# Altium project Bus.PrjPcb
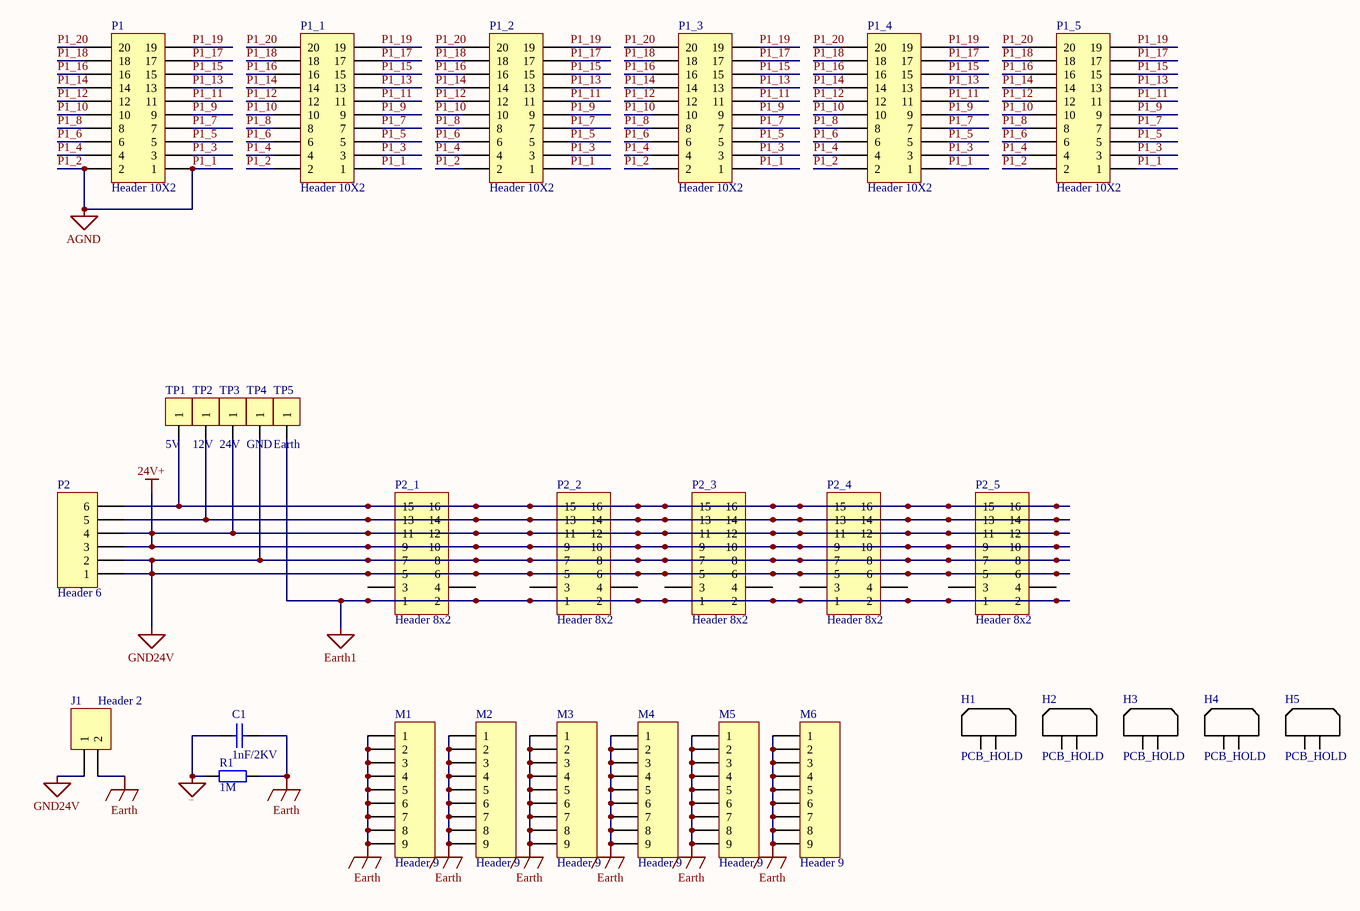
[diagram p0: Bus.SchDoc]
1 sheet, 31 parts. Net scope: global (net labels, ports and power ports of the same name join across sheets).
Board file: Bus.PcbDoc

## Sheet Bus.SchDoc
size A3

### Parts
C1  1nF/2KV  [1206_C]
H1  PCB_HOLD  [PCB_HOLD]
H2  PCB_HOLD  [PCB_HOLD]
H3  PCB_HOLD  [PCB_HOLD]
H4  PCB_HOLD  [PCB_HOLD]
H5  PCB_HOLD  [PCB_HOLD]
J1  Header 2  [HDR1X2]
M1  Header 9  [LK]
M2  Header 9  [LK]
M3  Header 9  [LK]
M4  Header 9  [LK]
M5  Header 9  [LK]
M6  Header 9  [LK]
P1  Header 10X2  [HDR2X10]
P1_1  Header 10X2  [HDR2X10]
P1_2  Header 10X2  [HDR2X10]
P1_3  Header 10X2  [HDR2X10]
P1_4  Header 10X2  [HDR2X10]
P1_5  Header 10X2  [HDR2X10]
P2  Header 6  [15EDG-6-R]
P2_1  Header 8x2  [HDR2X8]
P2_2  Header 8x2  [HDR2X8]
P2_3  Header 8x2  [HDR2X8]
P2_4  Header 8x2  [HDR2X8]
P2_5  Header 8x2  [HDR2X8]
R1  1M  [1206_R]
TP1  5V  [TP]
TP2  12V  [TP]
TP3  24V  [TP]
TP4  GND  [TP]
TP5  Earth  [TP]

### Nets
24V+: P2.3 P2.4 P2_1.9 P2_1.10 P2_1.11 P2_1.12 P2_2.9 P2_2.10 P2_2.11 P2_2.12 P2_3.9 P2_3.10 P2_3.11 P2_3.12 P2_4.9 P2_4.10 P2_4.11 P2_4.12 P2_5.9 P2_5.10 P2_5.11 P2_5.12 TP3.1
Earth: C1.1 J1.2 M1.1 M1.2 M1.3 M1.4 M1.5 M1.6 M1.7 M1.8 M1.9 M2.1 M2.2 M2.3 M2.4 M2.5 M2.6 M2.7 M2.8 M2.9 M3.1 M3.2 M3.3 M3.4 M3.5 M3.6 M3.7 M3.8 M3.9 M4.1 M4.2 M4.3 M4.4 M4.5 M4.6 M4.7 M4.8 M4.9 M5.1 M5.2 M5.3 M5.4 M5.5 M5.6 M5.7 M5.8 M5.9 M6.1 M6.2 M6.3 M6.4 M6.5 M6.6 M6.7 M6.8 M6.9 R1.2
Earth1: C1.2 P2_1.1 P2_1.2 P2_2.1 P2_2.2 P2_3.1 P2_3.2 P2_4.1 P2_4.2 P2_5.1 P2_5.2 R1.1 TP5.1
GND24V: J1.1 P2.1 P2.2 P2_1.5 P2_1.6 P2_1.7 P2_1.8 P2_2.5 P2_2.6 P2_2.7 P2_2.8 P2_3.5 P2_3.6 P2_3.7 P2_3.8 P2_4.5 P2_4.6 P2_4.7 P2_4.8 P2_5.5 P2_5.6 P2_5.7 P2_5.8 TP4.1
P1_1: P1.1 P1.2 P1_1.1 P1_1.2 P1_2.1 P1_2.2 P1_3.1 P1_3.2 P1_4.1 P1_4.2 P1_5.1 P1_5.2  [also labelled AGND, P1_2]
P1_3: P1.3 P1_1.3 P1_2.3 P1_3.3 P1_4.3 P1_5.3
P1_4: P1.4 P1_1.4 P1_2.4 P1_3.4 P1_4.4 P1_5.4
P1_5: P1.5 P1_1.5 P1_2.5 P1_3.5 P1_4.5 P1_5.5
P1_6: P1.6 P1_1.6 P1_2.6 P1_3.6 P1_4.6 P1_5.6
P1_7: P1.7 P1_1.7 P1_2.7 P1_3.7 P1_4.7 P1_5.7
P1_8: P1.8 P1_1.8 P1_2.8 P1_3.8 P1_4.8 P1_5.8
P1_9: P1.9 P1_1.9 P1_2.9 P1_3.9 P1_4.9 P1_5.9
P1_10: P1.10 P1_1.10 P1_2.10 P1_3.10 P1_4.10 P1_5.10
P1_11: P1.11 P1_1.11 P1_2.11 P1_3.11 P1_4.11 P1_5.11
P1_12: P1.12 P1_1.12 P1_2.12 P1_3.12 P1_4.12 P1_5.12
P1_13: P1.13 P1_1.13 P1_2.13 P1_3.13 P1_4.13 P1_5.13
P1_14: P1.14 P1_1.14 P1_2.14 P1_3.14 P1_4.14 P1_5.14
P1_15: P1.15 P1_1.15 P1_2.15 P1_3.15 P1_4.15 P1_5.15
P1_16: P1.16 P1_1.16 P1_2.16 P1_3.16 P1_4.16 P1_5.16
P1_17: P1.17 P1_1.17 P1_2.17 P1_3.17 P1_4.17 P1_5.17
P1_18: P1.18 P1_1.18 P1_2.18 P1_3.18 P1_4.18 P1_5.18
P1_19: P1.19 P1_1.19 P1_2.19 P1_3.19 P1_4.19 P1_5.19
P1_20: P1.20 P1_1.20 P1_2.20 P1_3.20 P1_4.20 P1_5.20
NetP2_5: P2.5 P2_1.13 P2_1.14 P2_2.13 P2_2.14 P2_3.13 P2_3.14 P2_4.13 P2_4.14 P2_5.13 P2_5.14 TP2.1
NetP2_6: P2.6 P2_1.15 P2_1.16 P2_2.15 P2_2.16 P2_3.15 P2_3.16 P2_4.15 P2_4.16 P2_5.15 P2_5.16 TP1.1

Not connected (* = marked no-connect by the designer): P2_1 3 4; P2_2 3 4; P2_3 3 4; P2_4 3 4; P2_5 3 4

### Library data of the parts
C1 = CC: Capacitor
J1 = Header 2: Header, 2-Pin; LatestRevisionDate: 17-Jul-2002; LatestRevisionNote: Re-released for DXP Platform.; Publisher: Altium Limited
M1-M6 = Header 9: Header, 9-Pin; LatestRevisionDate: 17-Jul-2002; LatestRevisionNote: Re-released for DXP Platform.; Publisher: Altium Limited
P1 P1_1-P1_5 = Header 10X2: Header, 10-Pin, Dual row; LatestRevisionDate: 17-Jul-2002; LatestRevisionNote: Re-released for DXP Platform.; Publisher: Altium Limited
P2 = Header 6: Header, 6-Pin; LatestRevisionDate: 17-Jul-2002; LatestRevisionNote: Re-released for DXP Platform.; Publisher: Altium Limited
P2_1-P2_5 = Header 8x2: Header, 8-Pin, Dual row; LatestRevisionDate: 17-Jul-2002; LatestRevisionNote: Re-released for DXP Platform.; Publisher: Altium Limited
R1 = Res2: Resistor; Value: 1K; Published: 8-Jun-2000; LatestRevisionDate: 17-Jul-2002; LatestRevisionNote: Re-released for DXP Platform.; PackageReference: AXIAL-0.4; Publisher: Altium Limited
TP1-TP5 = TP: LatestRevisionDate: 17-Jul-2002; LatestRevisionNote: Re-released for DXP Platform.; Publisher: Altium Limited
H1-H5 = PCB_HOLD: LatestRevisionDate: 17-Jul-2002; LatestRevisionNote: Re-released for DXP Platform.; Publisher: Altium Limited